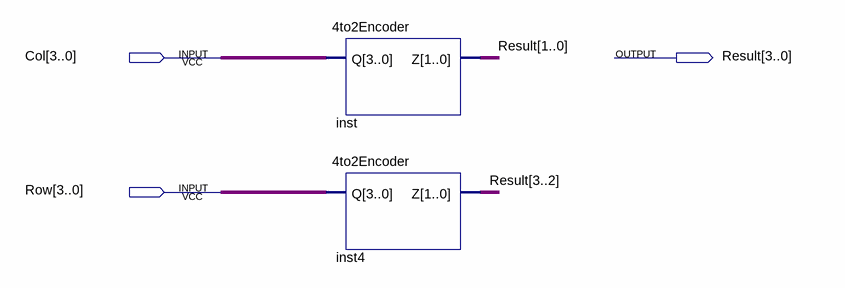
[diagram p0: schematic sheet]
// Quartus schematic KeyEncoder.bdf as structural Verilog: 2 symbols, 3 pins
module KeyEncoder (
  input  [3:0] Col,
  input  [3:0] Row,
  output [3:0] Result
);

  \4to2Encoder  inst (.Q(Col), .Z(Result[1:0]));
  \4to2Encoder  inst4 (.Q(Row), .Z(Result[3:2]));
endmodule
